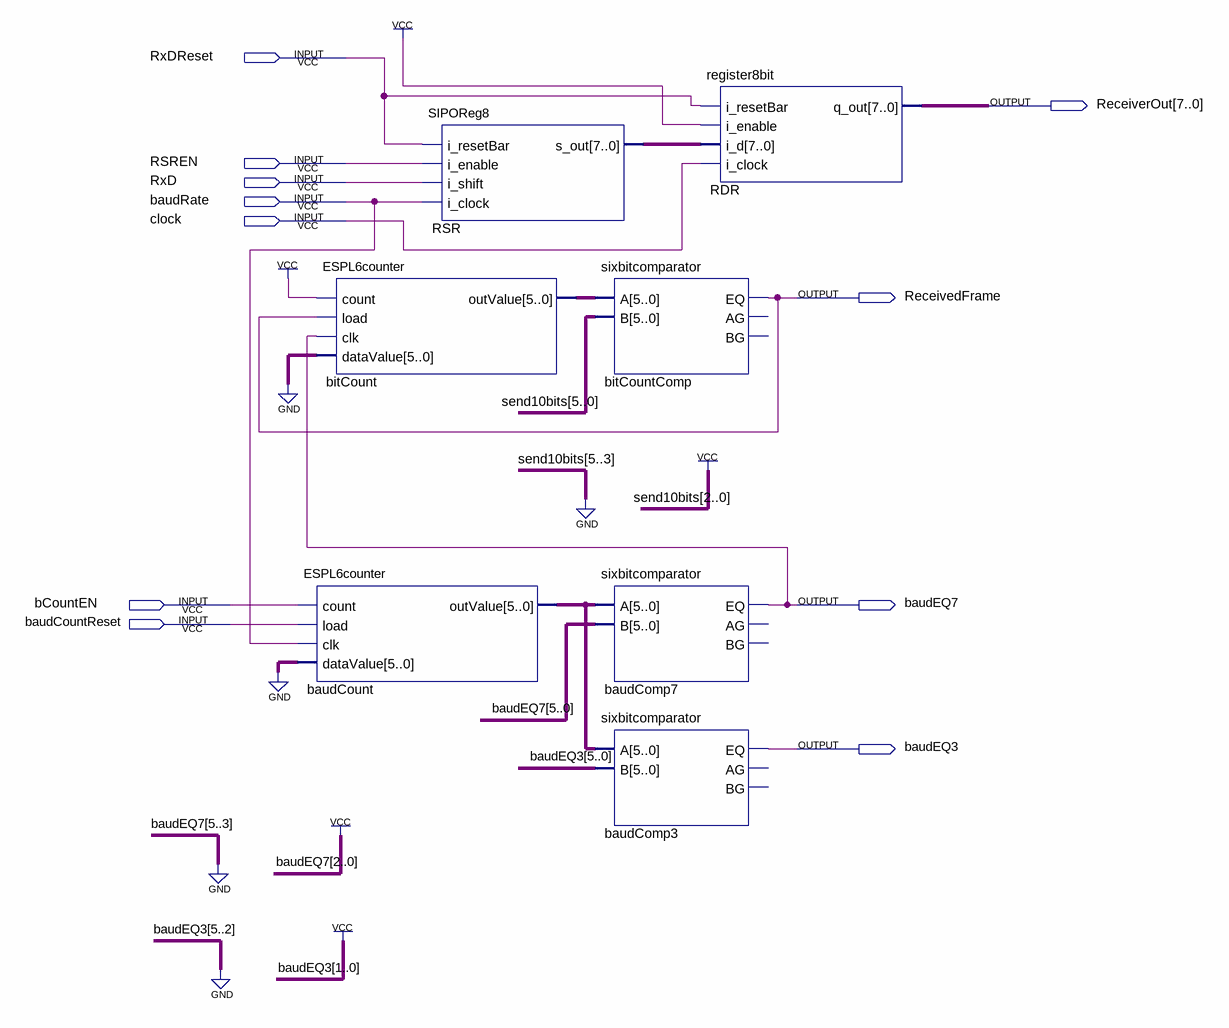
[diagram p0: schematic sheet]
// Quartus schematic receiverDataFlow.bdf as structural Verilog: 7 symbols, 11 pins
module receiverDataFlow (
  input  RxDReset,
  input  RSREN,
  input  RxD,
  input  baudRate,
  input  clock,
  input  bCountEN,
  input  baudCountReset,
  output [7:0] ReceiverOut,
  output ReceivedFrame,
  output baudEQ7,
  output baudEQ3
);

  wire [5:0] baudCount_outvalue, bitCount_outvalue;
  wire [7:0] RSR_s_out;

  ESPL6counter bitCount (
    .count(1'b1), .load(ReceivedFrame), .clk(baudEQ7), .dataValue({6{1'b0}}), .outValue(bitCount_outvalue));
  ESPL6counter baudCount (
    .count(bCountEN), .load(baudCountReset), .clk(baudRate), .dataValue({6{1'b0}}),
    .outValue(baudCount_outvalue));
  SIPOReg8 RSR (.i_resetBar(RxDReset), .i_enable(RSREN), .i_shift(RxD), .i_clock(baudRate), .s_out(RSR_s_out));
  sixbitcomparator bitCountComp (.A(bitCount_outvalue), .B(6'b000111), .EQ(ReceivedFrame));  // open: AG, BG
  sixbitcomparator baudComp7 (.A(baudCount_outvalue), .B(6'b000111), .EQ(baudEQ7));  // open: AG, BG
  sixbitcomparator baudComp3 (.A(baudCount_outvalue), .B(6'b000011), .EQ(baudEQ3));  // open: AG, BG
  register8bit RDR (.i_resetBar(RxDReset), .i_enable(1'b1), .i_d(RSR_s_out), .i_clock(clock), .q_out(ReceiverOut));
endmodule
